# Altium schematic sheet LED_Running_Light.SchDoc
size A4; SheetNumber: 1; SheetTotal: 1
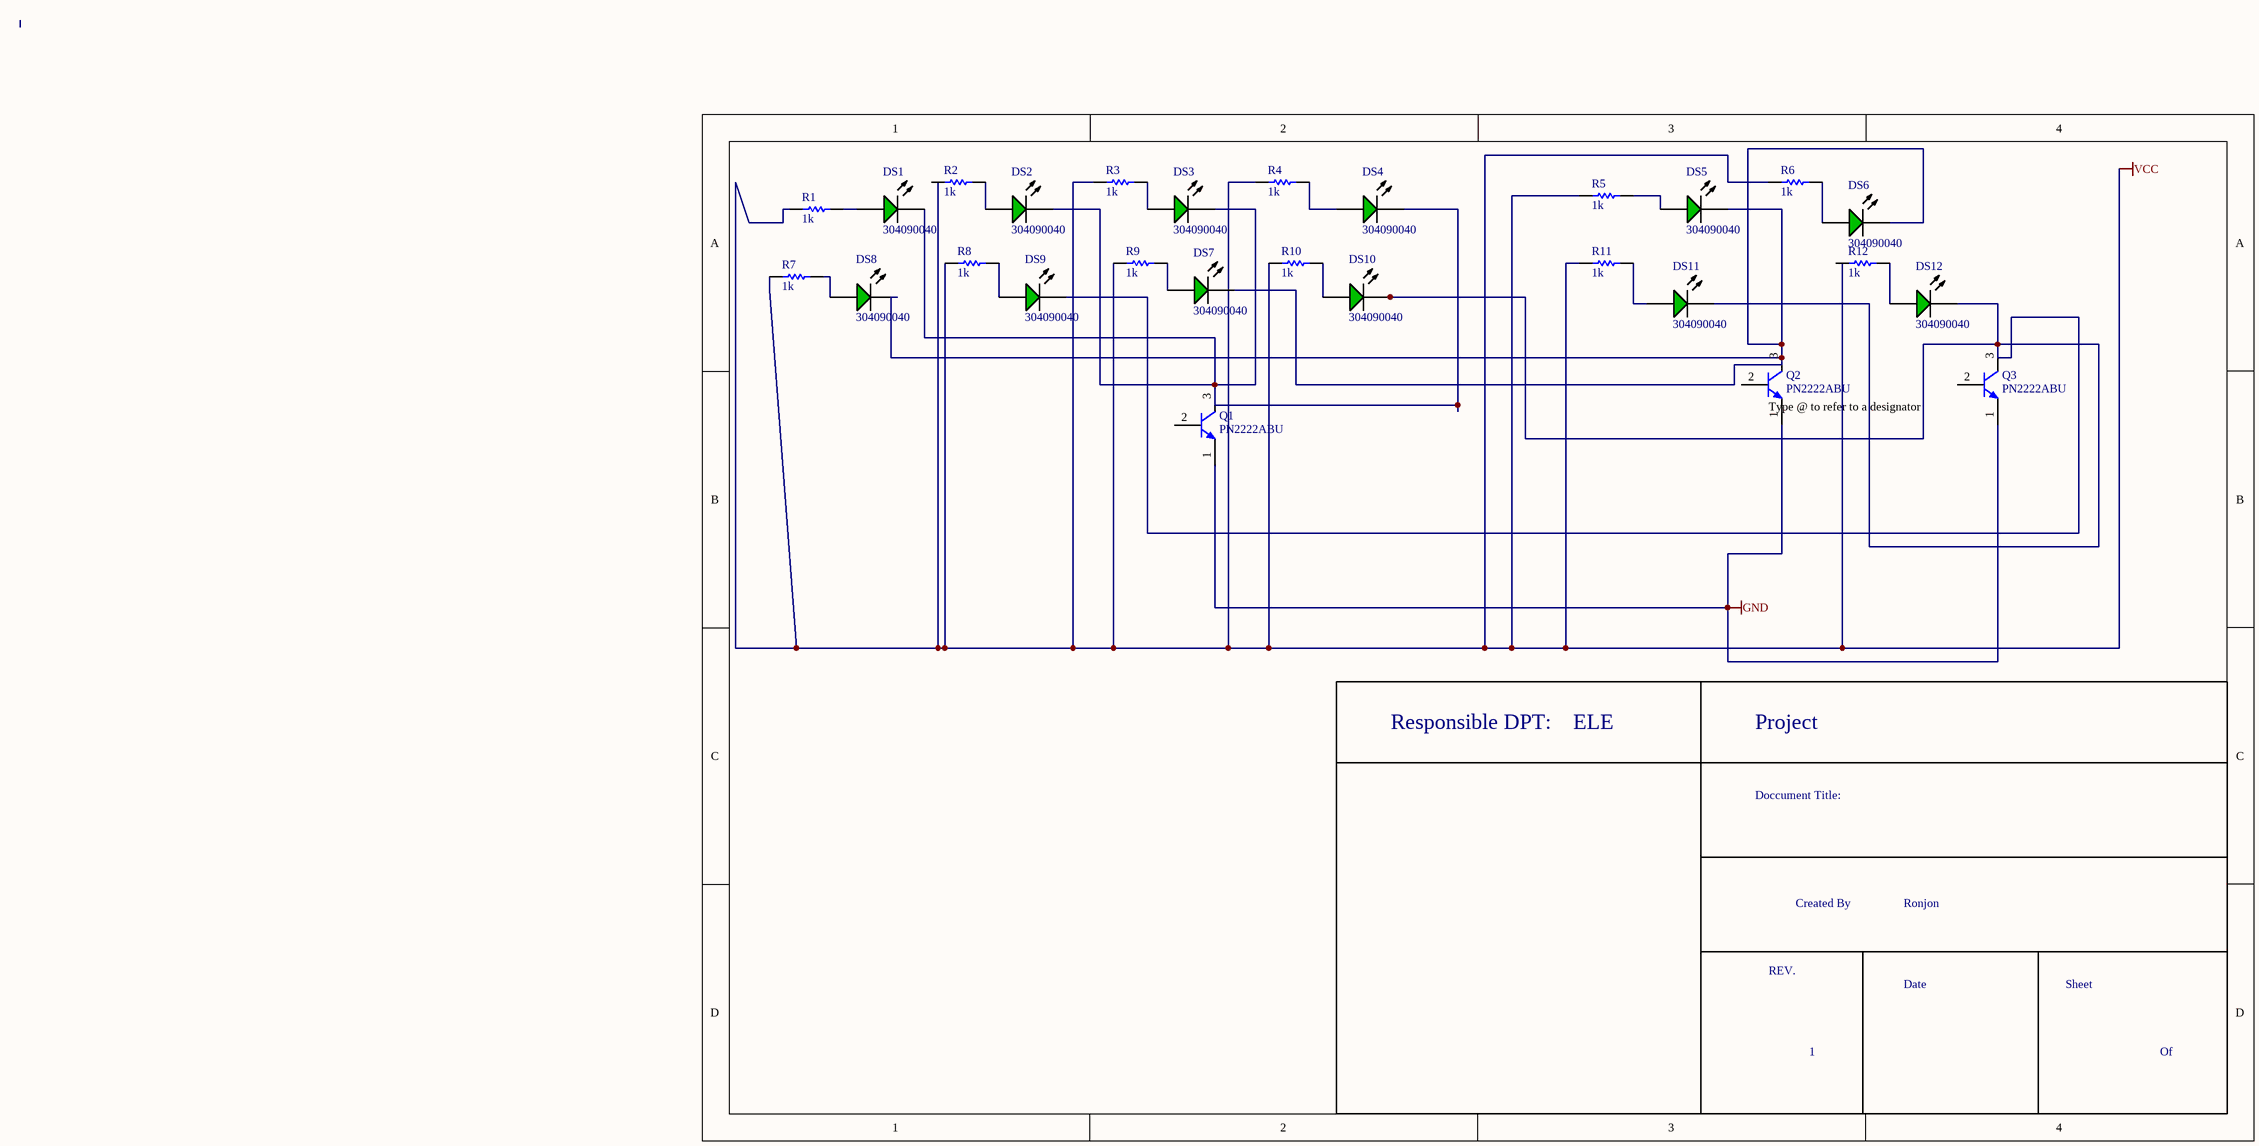
[diagram p0: LED_Running_Light.SchDoc]

## Parts
DS1  304090040  [LED-2P-2.28-3MM]
DS2  304090040  [LED-2P-2.28-3MM]
DS3  304090040  [LED-2P-2.28-3MM]
DS4  304090040  [LED-2P-2.28-3MM]
DS5  304090040  [LED-2P-2.28-3MM]
DS6  304090040  [LED-2P-2.28-3MM]
DS7  304090040  [LED-2P-2.28-3MM]
DS8  304090040  [LED-2P-2.28-3MM]
DS9  304090040  [LED-2P-2.28-3MM]
DS10  304090040  [LED-2P-2.28-3MM]
DS11  304090040  [LED-2P-2.28-3MM]
DS12  304090040  [LED-2P-2.28-3MM]
Q1  PN2222ABU  [FAIR-TO-92]
Q2  PN2222ABU  [FAIR-TO-92]
Q3  PN2222ABU  [FAIR-TO-92]
R1  value 1k  [RESC3116X70X50ML13T20]  (hidden comment: Resistor 1k +/-1% 1206 250 mW)
R2  value 1k  [RESC3116X70X50ML13T20]  (hidden comment: Resistor 1k +/-1% 1206 250 mW)
R3  value 1k  [RESC3116X70X50ML13T20]  (hidden comment: Resistor 1k +/-1% 1206 250 mW)
R4  value 1k  [RESC3116X70X50ML13T20]  (hidden comment: Resistor 1k +/-1% 1206 250 mW)
R5  value 1k  [RESC3116X70X50ML13T20]  (hidden comment: Resistor 1k +/-1% 1206 250 mW)
R6  value 1k  [RESC3116X70X50ML13T20]  (hidden comment: Resistor 1k +/-1% 1206 250 mW)
R7  value 1k  [RESC3116X70X50ML13T20]  (hidden comment: Resistor 1k +/-1% 1206 250 mW)
R8  value 1k  [RESC3116X70X50ML13T20]  (hidden comment: Resistor 1k +/-1% 1206 250 mW)
R9  value 1k  [RESC3116X70X50ML13T20]  (hidden comment: Resistor 1k +/-1% 1206 250 mW)
R10  value 1k  [RESC3116X70X50ML13T20]  (hidden comment: Resistor 1k +/-1% 1206 250 mW)
R11  value 1k  [RESC3116X70X50ML13T20]  (hidden comment: Resistor 1k +/-1% 1206 250 mW)
R12  value 1k  [RESC3116X70X50ML13T20]  (hidden comment: Resistor 1k +/-1% 1206 250 mW)

## Nets
GND: Q1.1(E) Q2.1(E) Q3.1(E)
VCC: R1.1 R2.1 R3.1 R4.1 R5.1 R6.1 R7.1 R8.1 R9.1 R10.1 R11.1 R12.1
NetDS1_1: DS1.1(A) R1.2
NetDS1_2: DS1.2(K) DS2.2(K) DS3.2(K) DS4.2(K) Q1.3(C)
NetDS2_1: DS2.1(A) R2.2
NetDS3_1: DS3.1(A) R3.2
NetDS4_1: DS4.1(A) R4.2
NetDS5_1: DS5.1(A) R5.2
NetDS5_2: DS5.2(K) DS6.2(K) DS7.2(K) DS8.2(K) Q2.3(C)
NetDS6_1: DS6.1(A) R6.2
NetDS7_1: DS7.1(A) R9.2
NetDS8_1: DS8.1(A) R7.2
NetDS9_1: DS9.1(A) R8.2
NetDS9_2: DS9.2(K) DS10.2(K) DS11.2(K) DS12.2(K) Q3.3(C)
NetDS10_1: DS10.1(A) R10.2
NetDS11_1: DS11.1(A) R11.2
NetDS12_1: DS12.1(A) R12.2

Not connected (* = marked no-connect by the designer): Q1 2(B); Q2 2(B); Q3 2(B)

## Notes on the sheet
- (near Q2) Type @ to refer to a designator
- Responsible DPT:    ELE
- Project
- Doccument Title:
- Created By
- Ronjon
- REV.
- Date
- Sheet
- 1
- Of

## Library data of the parts
DS1-DS12 = CMP-007-00006-2: Green LED, 80 mW, 20 mA, -25 to 85 degC, 2-Pin THD; Manufacturer: Shenzhen CGX; Manufacturer URL: http://szcgx.com/; Package Reference: 304090040; Datasheet Version: Rev. 1.0, 09/2014; RoHS Compliant: Unknown; Case/Package: 304090040; Package Description: 2-Pin Through Hole Device, Dia 3 mm, Pitch 2.28 mm; Datasheet URL: http://datasheet.octopart.com/304090040-Chengguangxing-datasheet-62330655.pdf; Mounting Technology: TH
Q1-Q3 = CMP-013-00009-3: NPN General-Purpose Amplifier, 40 V, -55 to 150 degC, 3-Pin TO-92, RoHS, Bulk; Manufacturer: Fairchild; Power: 625mW; Elements: 1; hFE Min: 100; Vce Max: 1V; Frequency: 300MHz; Mounting Technology: TH; Package Quantity: 1000; RoHS Compliant: True; Datasheet Version: Rev. 1.1.0, 07/2014; Max Operating Temperature: 150°C; Min Operating Temperature: -55°C; Package Reference: TO-92; Package Description: 3-Pin Transistor Outline Package, Body Dia 4.79 mm, Pitch 1.27 mm; Pins: 3; Packaging: Bulk; Datasheet URL: https://www.fairchildsemi.com/datasheets/PN/PN2222A.pdf; Case/Package: TO-226-3
R1-R12 = CMP-009-00011-5: Chip Resistor, 1 KOhm, +/- 1%, 0.25 W, -55 to 155 degC, 1206 (3216 Metric); Voltage Rating: 200V; Power: 250mW; Max Operating Temperature: 155°C; Mounting Technology: SM; Tolerance: 1%; Case/Package: 1206; RoHS Compliant: True; Min Operating Temperature: -55°C; Pins: 2